# Altium schematic sheet DAC.SchDoc
size A3; SheetNumber: 2; SheetTotal: 7
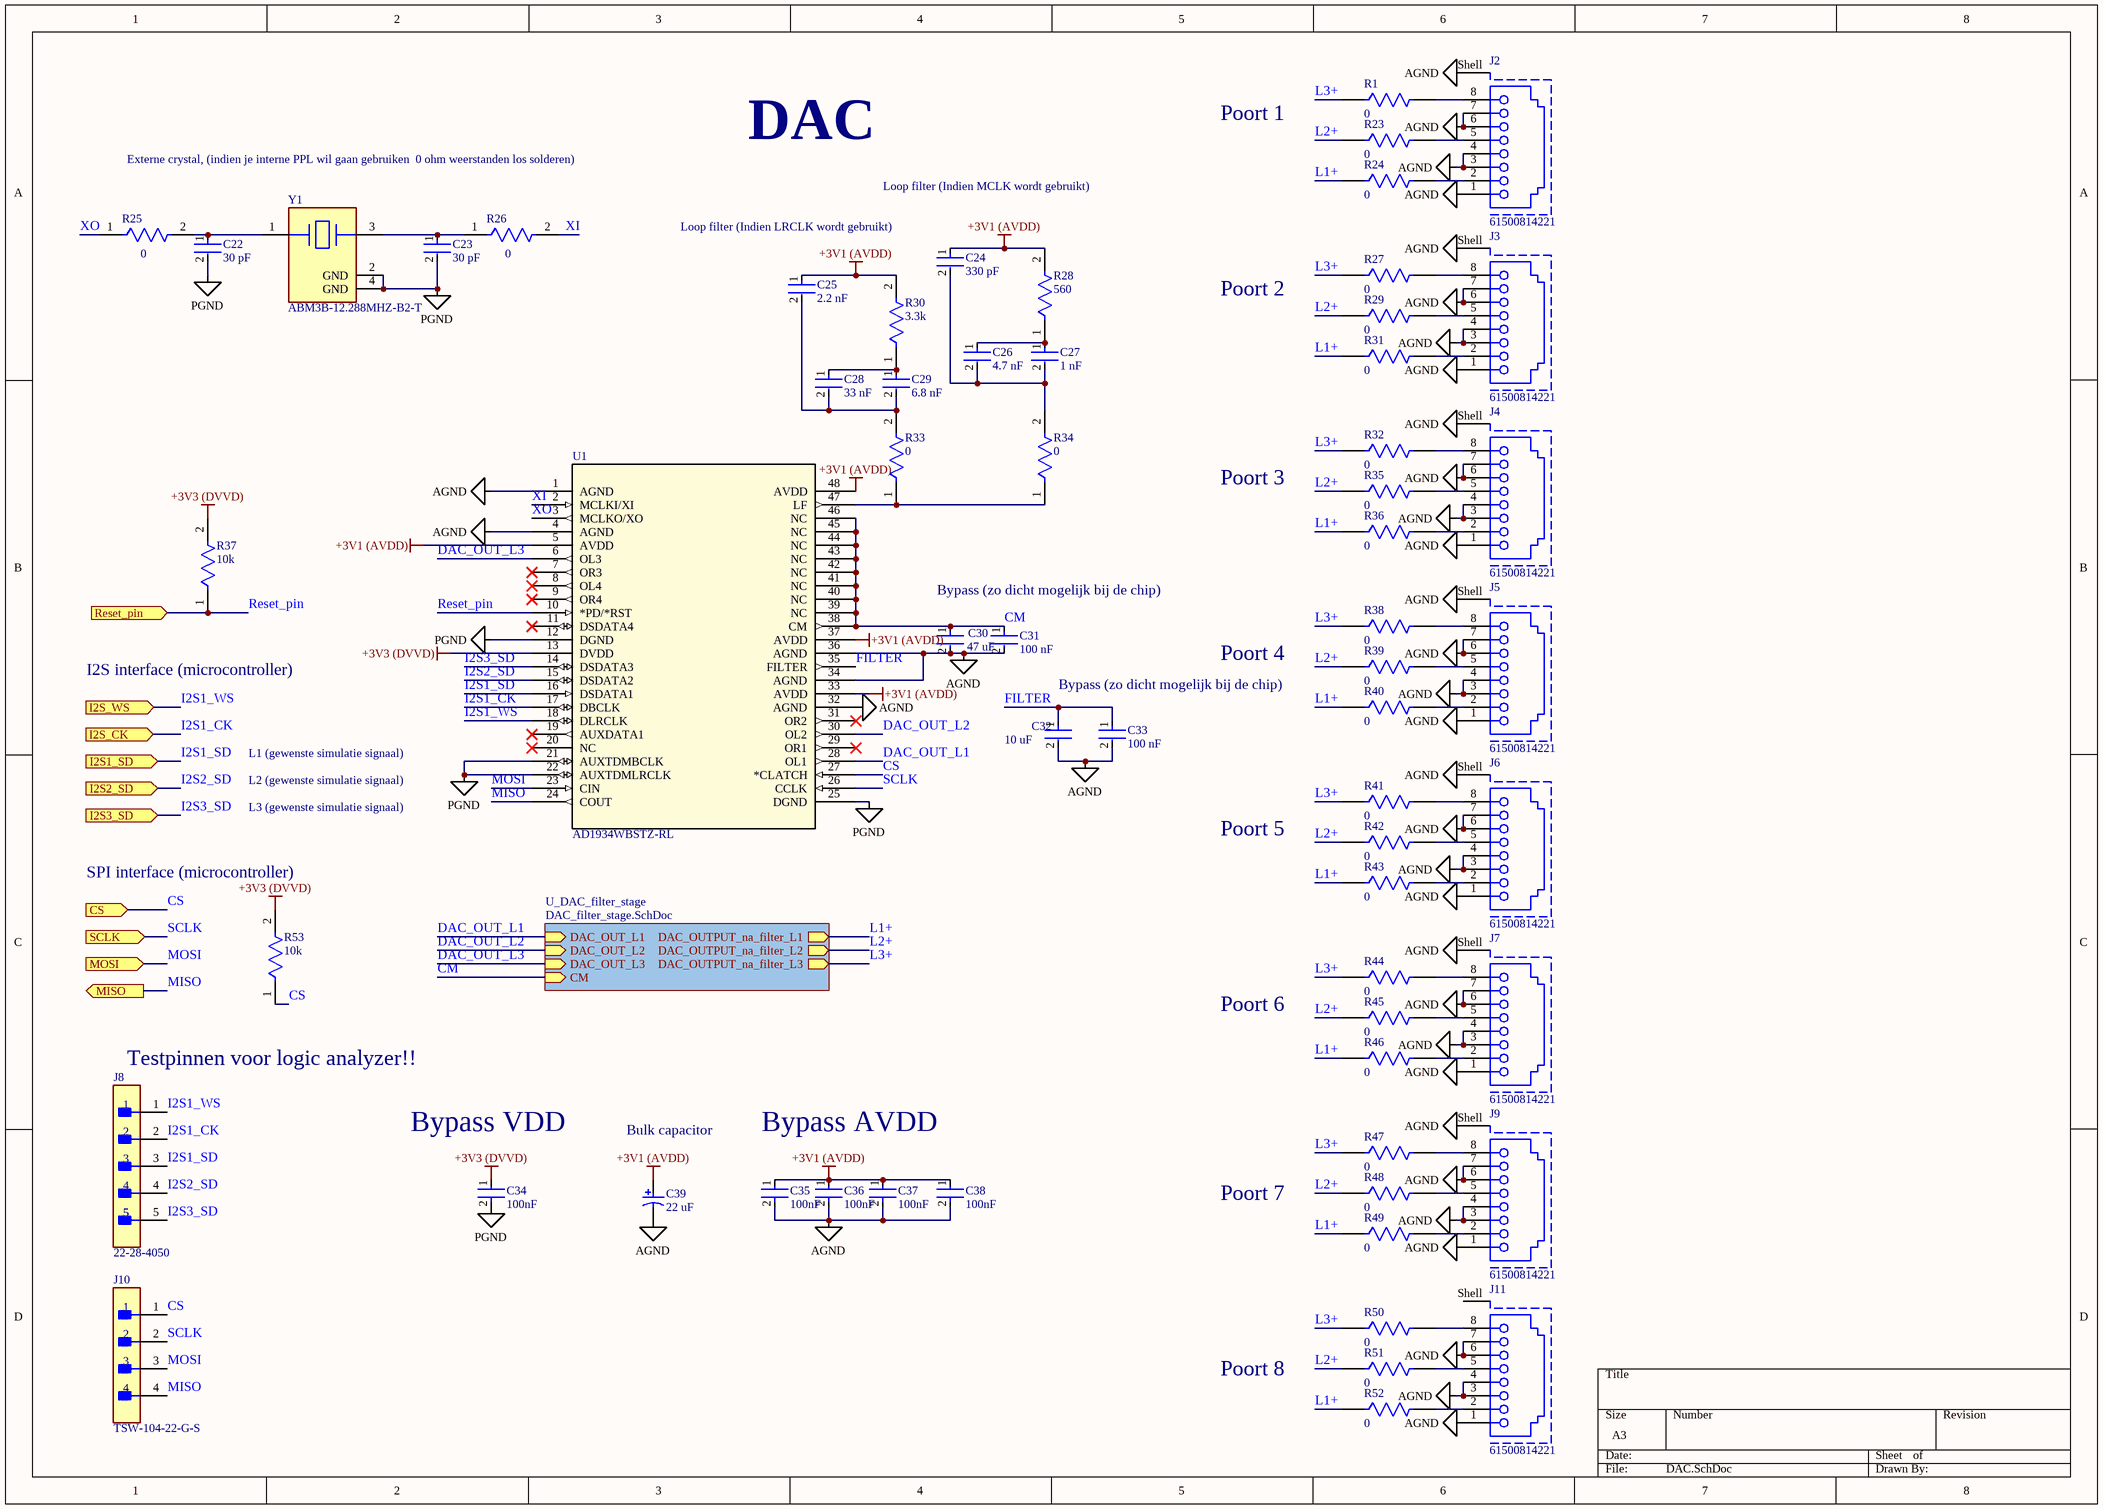
[diagram p0: DAC.SchDoc]

## Parts
C22  30 pF  [FP-AC0603-MFG]
C23  30 pF  [FP-AC0603-MFG]
C24  330 pF  [FP-C0603C-CF-MFG]
C25  2.2 nF  [FP-C0603C-CF-MFG]
C26  4.7 nF  [FP-C0603C-CF-MFG]
C27  1 nF  [FP-C0603C-CF-MFG]
C28  33 nF  [FP-C0603C-CF-MFG]
C29  6.8 nF  [FP-C0603C-CF-MFG]
C30  47 uF  [FP-C0805C476M9PACTU-MFG]
C31  100 nF  [FP-C0603C-CF-MFG]
C32  10 uF  [FP-C0603C-CF-MFG]
C33  100 nF  [FP-C0603C-CF-MFG]
C34  100nF  [FP-GRM15-MFG]
C35  100nF  [FP-GRM15-MFG]
C36  100nF  [FP-GRM15-MFG]
C37  100nF  [FP-GRM15-MFG]
C38  100nF  [FP-GRM15-MFG]
C39  22 uF  [CAPPR55-200-1100X500X1200]
J2  61500814221  [61500814221]
J3  61500814221  [61500814221]
J4  61500814221  [61500814221]
J5  61500814221  [61500814221]
J6  61500814221  [61500814221]
J7  61500814221  [61500814221]
J8  22-28-4050  [FP-22-28-4050-MFG]
J9  61500814221  [61500814221]
J10  TSW-104-22-G-S  [FP-TSW-104-22-G-S-MFG]
J11  61500814221  [61500814221]
R1  0  [FP-CRCW1206-MFG]
R23  0  [FP-CRCW1206-MFG]
R24  0  [FP-CRCW1206-MFG]
R25  0  [FP-CRCW1206-MFG]
R26  0  [FP-CRCW1206-MFG]
R27  0  [FP-CRCW1206-MFG]
R28  560  [FP-RC1608-IPC_B]
R29  0  [FP-CRCW1206-MFG]
R30  3.3k  [FP-RC1608-IPC_B]
R31  0  [FP-CRCW1206-MFG]
R32  0  [FP-CRCW1206-MFG]
R33  0  [FP-CRCW1206-MFG]
R34  0  [FP-CRCW1206-MFG]
R35  0  [FP-CRCW1206-MFG]
R36  0  [FP-CRCW1206-MFG]
R37  10k  [FP-RC1608-IPC_B]
R38  0  [FP-CRCW1206-MFG]
R39  0  [FP-CRCW1206-MFG]
R40  0  [FP-CRCW1206-MFG]
R41  0  [FP-CRCW1206-MFG]
R42  0  [FP-CRCW1206-MFG]
R43  0  [FP-CRCW1206-MFG]
R44  0  [FP-CRCW1206-MFG]
R45  0  [FP-CRCW1206-MFG]
R46  0  [FP-CRCW1206-MFG]
R47  0  [FP-CRCW1206-MFG]
R48  0  [FP-CRCW1206-MFG]
R49  0  [FP-CRCW1206-MFG]
R50  0  [FP-CRCW1206-MFG]
R51  0  [FP-CRCW1206-MFG]
R52  0  [FP-CRCW1206-MFG]
R53  10k  [FP-RC1608-IPC_B]
U1  AD1934WBSTZ-RL  [ST_48_ADI]
Y1  ABM3B-12.288MHZ-B2-T  [FP-ABM3B-MFG]

## Sub-sheets
U_DAC_filter_stage = DAC_filter_stage.SchDoc: DAC_OUT_L1 (in), DAC_OUT_L2 (in), DAC_OUT_L3 (in), CM (in), DAC_OUTPUT_na_filter_L2 (out), DAC_OUTPUT_na_filter_L1 (out), DAC_OUTPUT_na_filter_L3 (out)

## Ports
CS (in, see TOP_scheet[3C]), I2S1_SD (in, see TOP_scheet[3B], MCU[4B]), I2S2_SD (in, see TOP_scheet[3B], MCU[5B]), I2S3_SD (in, see TOP_scheet[3B], MCU[4B]), I2S_CK (in, see TOP_scheet[3B]), I2S_WS (in, see TOP_scheet[3B]), MISO (out, see TOP_scheet[3B]), MOSI (in, see TOP_scheet[3C]), Reset_pin (in, see TOP_scheet[3B]), SCLK (in, see TOP_scheet[3B])

## Nets
+3V1 (AVDD): C24.1 C25.1 C35.1 C36.1 C37.1 C38.1 C39.1 R28.2 R30.2 U1.5(AVDD) U1.33(AVDD) U1.37(AVDD) U1.48(AVDD)
+3V3 (DVVD): C34.1 R37.2 R53.2 U1.13(DVDD)
AGND: C30.2 C31.2 C32.2 C33.2 C35.2 C36.2 C37.2 C38.2 C39.2 J2.1 J2.3 J2.4 J2.6 J2.7 J2.Shell J3.1 J3.3 J3.4 J3.6 J3.7 J3.Shell J4.1 J4.3 J4.4 J4.6 J4.7 J4.Shell J5.1 J5.3 J5.4 J5.6 J5.7 J5.Shell J6.1 J6.3 J6.4 J6.6 J6.7 J6.Shell J7.1 J7.3 J7.4 J7.6 J7.7 J7.Shell J9.1 J9.3 J9.4 J9.6 J9.7 J9.Shell J11.1 J11.3 J11.4 J11.6 J11.7 U1.1(AGND) U1.4(AGND) U1.32(AGND) U1.34(AGND) U1.36(AGND)
PGND: C22.2 C23.2 C34.2 U1.12(DGND) U1.21(AUXTDMBCLK) U1.22(AUXTDMLRCLK) U1.25(DGND) Y1.2(GND) Y1.4(GND)
CM: C30.1 C31.1 U1.38(CM) U1.39(NC) U1.40(NC) U1.41(NC) U1.42(NC) U1.43(NC) U1.44(NC) U1.45(NC) U1.46(NC) ; sheet U_DAC_filter_stage/CM
CS: J10.1 R53.1 U1.27(*CLATCH) ; port CS
DAC_OUT_L1: U1.28(OL1) ; sheet U_DAC_filter_stage/DAC_OUT_L1
DAC_OUT_L2: U1.30(OL2) ; sheet U_DAC_filter_stage/DAC_OUT_L2
DAC_OUT_L3: U1.6(OL3) ; sheet U_DAC_filter_stage/DAC_OUT_L3
FILTER: C32.1 C33.1 U1.35(FILTER)
I2S1_CK: J8.2 U1.17(DBCLK) ; port I2S_CK
I2S1_SD: J8.3 U1.16(DSDATA1) ; port I2S1_SD
I2S1_WS: J8.1 U1.18(DLRCLK) ; port I2S_WS
I2S2_SD: J8.4 U1.15(DSDATA2) ; port I2S2_SD
I2S3_SD: J8.5 U1.14(DSDATA3) ; port I2S3_SD
L1+: R24.1 R31.1 R36.1 R40.1 R43.1 R46.1 R49.1 R52.1 ; sheet U_DAC_filter_stage/DAC_OUTPUT_na_filter_L1
L2+: R23.1 R29.1 R35.1 R39.1 R42.1 R45.1 R48.1 R51.1 ; sheet U_DAC_filter_stage/DAC_OUTPUT_na_filter_L2
L3+: R1.1 R27.1 R32.1 R38.1 R41.1 R44.1 R47.1 R50.1 ; sheet U_DAC_filter_stage/DAC_OUTPUT_na_filter_L3
MISO: J10.4 U1.24(COUT) ; port MISO
MOSI: J10.3 U1.23(CIN) ; port MOSI
Reset_pin: R37.1 U1.10(*PD/*RST) ; port Reset_pin
SCLK: J10.2 U1.26(CCLK) ; port SCLK
XI: R26.2 U1.2(MCLKI/XI)
XO: R25.1 U1.3(MCLKO/XO)
NetC22_1: C22.1 R25.2 Y1.1
NetC23_1: C23.1 R26.1 Y1.3
NetC24_2: C24.2 C26.2 C27.2 R34.2
NetC25_2: C25.2 C28.2 C29.2 R33.2
NetC26_1: C26.1 C27.1 R28.1
NetC28_1: C28.1 C29.1 R30.1
NetJ2_2: J2.2 R24.2
NetJ2_5: J2.5 R23.2
NetJ2_8: J2.8 R1.2
NetJ3_2: J3.2 R31.2
NetJ3_5: J3.5 R29.2
NetJ3_8: J3.8 R27.2
NetJ4_2: J4.2 R36.2
NetJ4_5: J4.5 R35.2
NetJ4_8: J4.8 R32.2
NetJ5_2: J5.2 R40.2
NetJ5_5: J5.5 R39.2
NetJ5_8: J5.8 R38.2
NetJ6_2: J6.2 R43.2
NetJ6_5: J6.5 R42.2
NetJ6_8: J6.8 R41.2
NetJ7_2: J7.2 R46.2
NetJ7_5: J7.5 R45.2
NetJ7_8: J7.8 R44.2
NetJ9_2: J9.2 R49.2
NetJ9_5: J9.5 R48.2
NetJ9_8: J9.8 R47.2
NetJ11_2: J11.2 R52.2
NetJ11_5: J11.5 R51.2
NetJ11_8: J11.8 R50.2
NetR33_1: R33.1 R34.1 U1.47(LF)

Not connected (* = marked no-connect by the designer): J11 Shell; U1 7(OR3)* 8(OL4)* 9(OR4)* 11(DSDATA4)* 19(AUXDATA1)* 20(NC)* 29(OR1)* 31(OR2)*

## Notes on the sheet
- Externe crystal, (indien je interne PPL wil gaan gebruiken  0 ohm weerstanden los solderen)
- DAC
- Poort 1
- Loop filter (Indien LRCLK wordt gebruikt)
- Loop filter (Indien MCLK wordt gebruikt)
- Poort 2
- Poort 3
- Bypass (zo dicht mogelijk bij de chip)
- I2S interface (microcontroller)
- Poort 4
- L1 (gewenste simulatie signaal)
- L2 (gewenste simulatie signaal)
- L3 (gewenste simulatie signaal)
- Poort 5
- SPI interface (microcontroller)
- Poort 6
- (near J8) Testpinnen voor logic analyzer!!
- (near C34) Bypass VDD
- Bulk capacitor
- Bypass AVDD
- Poort 7
- Poort 8

## Library data of the parts
C22 C23 = CMP-03422-001062-1: AC0603 30 pF NP0 5.00% 50 V; Manufacturer Part Number: AC0603JRNPO9BN271; Manufacturer: Yageo; Generic part Eurocircuits:: GPC0603300; Material: Ceramic; Tolerance: 0.05; Voltage Rating: 50 V; Temperature Coefficient: 15%; Automotive Grade: Grade 1; ComponentLink2URL: http://www.yageo.com/documents/recent/UPY-AC_NP0X7R_16V-to-630V_12.pdf; Value: 30 pF; Capacitance: 30 pF; Lead Free: Yes; Automotive: Yes; Package: AC0603; RoHS: TRUE; Device Class L2: Capacitors; Footprint Url: http://www.yageo.com/exep/pages/download/literatures/UPY-C_GEN_24.pdf; Height: 0.9mm; Category: Cap; Device Class L1: Passive Components; Temperature: -55°C to +125°C; Ipc Land Pattern Name: CAPC16080X80; Octopart: https://octopart.com/ac0603jrnpo9bn271-yageo-87214073; ComponentLink2Description: Datasheet; Device Class L3: Ceramic Capacitors; Temperature Characteristic: NP0; Temperature Range High: +125°C; Temperature Range Low: -55°C
C24 = CMP-2006-03056-2: CAP CER 330 pF 50V 5% X7R 0603; Manufacturer Part Number: C0603C104J5RACTU; Manufacturer: KEMET; Generic part Eurocircuits:: GPC0603331; Automotive Grade: Grade 1; Tolerance: 0.05; Material: Ceramic; Temperature Coefficient: 30ppm/°C; ComponentLink2Description: Datasheet; Voltage Rating: 50 V; Digikey Description: CAP CER 0.1UF 50V 5% X7R 0603; Temperature Range High: +125°C; Device Class L2: Capacitors; Capacitance: 330 pF; Value: 330 pF; Octopart: https://octopart.com/c0603c104j5ractu-kemet-10440638; RoHS: TRUE; Mouser Description: Multilayer Ceramic Capacitors MLCC - SMD/SMT 50volts 0.1uF X7R 5%; Temperature Range Low: -55°C; Automotive: Yes; Lead Free: Yes; ComponentLink2URL: https://api.kemet.com/component-edge/download/datasheet/C0603C100J5GACAUTO.pdf; Device Class L3: Ceramic Capacitors; Package: C0603C-CF; Category: Cap; Temperature: -55°C to +125°C; Height: 0.87mm; Temperature Characteristic: X7R; Device Class L1: Passive Components
C25 = CMP-2006-03056-2: CAP CER 2.2 nF 50V 5% X7R 0603; Manufacturer Part Number: C0603C104J5RACTU; Manufacturer: KEMET; Generic part Eurocircuits:: GPC0603222; Automotive Grade: Grade 1; Tolerance: 0.05; Material: Ceramic; Temperature Coefficient: 30ppm/°C; ComponentLink2Description: Datasheet; Voltage Rating: 50 V; Digikey Description: CAP CER 0.1UF 50V 5% X7R 0603; Temperature Range High: +125°C; Device Class L2: Capacitors; Capacitance: 2.2 nF; Value: 2.2 nF; Octopart: https://octopart.com/c0603c104j5ractu-kemet-10440638; RoHS: TRUE; Mouser Description: Multilayer Ceramic Capacitors MLCC - SMD/SMT 50volts 0.1uF X7R 5%; Temperature Range Low: -55°C; Automotive: Yes; Lead Free: Yes; ComponentLink2URL: https://api.kemet.com/component-edge/download/datasheet/C0603C100J5GACAUTO.pdf; Device Class L3: Ceramic Capacitors; Package: C0603C-CF; Category: Cap; Temperature: -55°C to +125°C; Height: 0.87mm; Temperature Characteristic: X7R; Device Class L1: Passive Components
C26 = CMP-2006-03056-2: CAP CER 33 nF 50V 5% X7R 0603; Manufacturer Part Number: C0603C104J5RACTU; Manufacturer: KEMET; Generic part Eurocircuits:: GPC0603472; Automotive Grade: Grade 1; Tolerance: 0.05; Material: Ceramic; Temperature Coefficient: 30ppm/°C; ComponentLink2Description: Datasheet; Voltage Rating: 50 V; Digikey Description: CAP CER 0.1UF 50V 5% X7R 0603; Temperature Range High: +125°C; Device Class L2: Capacitors; Capacitance: 4.7 nF; Value: 4.7 nF; Octopart: https://octopart.com/c0603c104j5ractu-kemet-10440638; RoHS: TRUE; Mouser Description: Multilayer Ceramic Capacitors MLCC - SMD/SMT 50volts 0.1uF X7R 5%; Temperature Range Low: -55°C; Automotive: Yes; Lead Free: Yes; ComponentLink2URL: https://api.kemet.com/component-edge/download/datasheet/C0603C100J5GACAUTO.pdf; Device Class L3: Ceramic Capacitors; Package: C0603C-CF; Category: Cap; Temperature: -55°C to +125°C; Height: 0.87mm; Temperature Characteristic: X7R; Device Class L1: Passive Components
C27 = CMP-2006-03056-2: CAP CER 1 nF 50V 5% X7R 0603; Manufacturer Part Number: C0603C104J5RACTU; Manufacturer: KEMET; Generic part Eurocircuits:: GPC0603102; Automotive Grade: Grade 1; Tolerance: 0.05; Material: Ceramic; Temperature Coefficient: 30ppm/°C; ComponentLink2Description: Datasheet; Voltage Rating: 50 V; Digikey Description: CAP CER 0.1UF 50V 5% X7R 0603; Temperature Range High: +125°C; Device Class L2: Capacitors; Capacitance: 1 nF; Value: 1 nF; Octopart: https://octopart.com/c0603c104j5ractu-kemet-10440638; RoHS: TRUE; Mouser Description: Multilayer Ceramic Capacitors MLCC - SMD/SMT 50volts 0.1uF X7R 5%; Temperature Range Low: -55°C; Automotive: Yes; Lead Free: Yes; ComponentLink2URL: https://api.kemet.com/component-edge/download/datasheet/C0603C100J5GACAUTO.pdf; Device Class L3: Ceramic Capacitors; Package: C0603C-CF; Category: Cap; Temperature: -55°C to +125°C; Height: 0.87mm; Temperature Characteristic: X7R; Device Class L1: Passive Components
C28 = CMP-2006-03056-2: CAP CER 33 nF 50V 5% X7R 0603; Manufacturer Part Number: C0603C104J5RACTU; Manufacturer: KEMET; Generic part Eurocircuits:: GPC0603333; Automotive Grade: Grade 1; Tolerance: 0.05; Material: Ceramic; Temperature Coefficient: 30ppm/°C; ComponentLink2Description: Datasheet; Voltage Rating: 50 V; Digikey Description: CAP CER 0.1UF 50V 5% X7R 0603; Temperature Range High: +125°C; Device Class L2: Capacitors; Capacitance: 33 nF; Value: 33 nF; Octopart: https://octopart.com/c0603c104j5ractu-kemet-10440638; RoHS: TRUE; Mouser Description: Multilayer Ceramic Capacitors MLCC - SMD/SMT 50volts 0.1uF X7R 5%; Temperature Range Low: -55°C; Automotive: Yes; Lead Free: Yes; ComponentLink2URL: https://api.kemet.com/component-edge/download/datasheet/C0603C100J5GACAUTO.pdf; Device Class L3: Ceramic Capacitors; Package: C0603C-CF; Category: Cap; Temperature: -55°C to +125°C; Height: 0.87mm; Temperature Characteristic: X7R; Device Class L1: Passive Components
C29 = CMP-2006-03056-2: CAP CER 6.8 nF 50V 5% X7R 0603; Manufacturer Part Number: C0603C104J5RACTU; Manufacturer: KEMET; Generic part Eurocircuits:: GPC0603682; Automotive Grade: Grade 1; Tolerance: 0.05; Material: Ceramic; Temperature Coefficient: 30ppm/°C; ComponentLink2Description: Datasheet; Voltage Rating: 50 V; Digikey Description: CAP CER 0.1UF 50V 5% X7R 0603; Temperature Range High: +125°C; Device Class L2: Capacitors; Capacitance: 6.8 nF; Value: 6.8 nF; Octopart: https://octopart.com/c0603c104j5ractu-kemet-10440638; RoHS: TRUE; Mouser Description: Multilayer Ceramic Capacitors MLCC - SMD/SMT 50volts 0.1uF X7R 5%; Temperature Range Low: -55°C; Automotive: Yes; Lead Free: Yes; ComponentLink2URL: https://api.kemet.com/component-edge/download/datasheet/C0603C100J5GACAUTO.pdf; Device Class L3: Ceramic Capacitors; Package: C0603C-CF; Category: Cap; Temperature: -55°C to +125°C; Height: 0.87mm; Temperature Characteristic: X7R; Device Class L1: Passive Components
C30 = CMP-2007-01008-2: CAP CER 47UF 6.3V X5R 0805; Generic part Eurocircuits:: GPC0805476-6.3; Dielectric Material: Ceramic; Dissipation Factor: 5%; Tolerance: 20%; Case Code (Imperial): 0805; Mount: PCB; Width: 1.2mm; Package Quantity: 3000; Radiation Hardening: No; Packaging: Tape and Reel; Termination: SMD/SMT; Series: C0805C; Voltage: 6.3V; Depth: 1.25mm; Dielectric: X5R; Case Code (Metric): 2012; Length: 2mm; Case/Package: 0805; REACH SVHC: No SVHC; Voltage Rating (DC): 6.3V; Capacitance: 47uF; RoHS Compliant: Yes; Height: 1.25mm; Construction: Flat; Number of Pins: 2; Voltage Rating: 6.3V; Max Operating Temperature: 85°C; Min Operating Temperature: -55°C; Parameter 1: *
C31 C33 = CMP-2006-03056-2: CAP CER 100 nF 50V 5% X7R 0603; Manufacturer Part Number: C0603C104J5RACTU; Manufacturer: KEMET; Generic part Eurocircuits:: GPC0603104; Automotive Grade: Grade 1; Tolerance: 0.05; Material: Ceramic; Temperature Coefficient: 30ppm/°C; ComponentLink2Description: Datasheet; Voltage Rating: 50 V; Digikey Description: CAP CER 0.1UF 50V 5% X7R 0603; Temperature Range High: +125°C; Device Class L2: Capacitors; Capacitance: 100 nF; Value: 100 nF; Octopart: https://octopart.com/c0603c104j5ractu-kemet-10440638; RoHS: TRUE; Mouser Description: Multilayer Ceramic Capacitors MLCC - SMD/SMT 50volts 0.1uF X7R 5%; Temperature Range Low: -55°C; Automotive: Yes; Lead Free: Yes; ComponentLink2URL: https://api.kemet.com/component-edge/download/datasheet/C0603C100J5GACAUTO.pdf; Device Class L3: Ceramic Capacitors; Package: C0603C-CF; Category: Cap; Temperature: -55°C to +125°C; Height: 0.87mm; Temperature Characteristic: X7R; Device Class L1: Passive Components
C32 = CMP-2006-03056-2: CAP CER 10 uF 50V 5% X7R 0603; Manufacturer Part Number: C0603C104J5RACTU; Manufacturer: KEMET; Generic part Eurocircuits:: GPC0603106-10; Automotive Grade: Grade 1; Tolerance: 0.05; Material: Ceramic; Temperature Coefficient: 30ppm/°C; ComponentLink2Description: Datasheet; Voltage Rating: 50 V; Digikey Description: CAP CER 0.1UF 50V 5% X7R 0603; Temperature Range High: +125°C; Device Class L2: Capacitors; Capacitance: 10 uF; Value: 10 uF; Octopart: https://octopart.com/c0603c104j5ractu-kemet-10440638; RoHS: TRUE; Mouser Description: Multilayer Ceramic Capacitors MLCC - SMD/SMT 50volts 0.1uF X7R 5%; Temperature Range Low: -55°C; Automotive: Yes; Lead Free: Yes; ComponentLink2URL: https://api.kemet.com/component-edge/download/datasheet/C0603C100J5GACAUTO.pdf; Device Class L3: Ceramic Capacitors; Package: C0603C-CF; Category: Cap; Temperature: -55°C to +125°C; Height: 0.87mm; Temperature Characteristic: X7R; Device Class L1: Passive Components
C34-C38 = CMP-2100-03641-2: CAP CER 0.1UF 16V X7R 0402; Manufacturer Part Number: GRM155R71C104KA88D; Manufacturer: Murata; Eurocircuits generic parts: GPC0402104; Standoff Height: 0mm; Tolerance: 10%; Voltage Rating: 16Vdc; Material: Ceramic; Capacitance: 0.10μF; Value: 0.10μF; RoHS: TRUE; Temperature Characteristic: X7R; Octopart: https://octopart.com/grm155r71c104ka88d-murata-196880; Digikey Description: CAP CER 0.1UF 16V X7R 0402; Device Class L3: Ceramic Capacitors; Height: 0.55mm; ComponentLink2Description: Datasheet; Temperature Range Low: -55°C; Ipc Land Pattern Name: CAPC10050X219; ComponentLink2URL: https://search.murata.co.jp/Ceramy/image/img/A01X/G101/ENG/GRM155R71H471KA01-01A.pdf; Device Class L1: Passive Components; Lead Free: yes; Category: Cap; Package: GRM15; Temperature: -55°C to +125°C; Device Class L2: Capacitors; Temperature Range High: +125°C; Mouser Description: 0402 0.1 uF 16V ±10 % Tolerance X7R SMT Multilayer Ceramic Capacitor
C39 = CMP-1665-00036-2: Aluminum Electrolytic Capacitor, 22 uF, +/- 20%, 50 V, -40 to 85 degC, 2-Pin THD, RoHS, Bulk; Manufacturer: Panasonic; Ripple Current: 100mA; Life (Hours): 2000Hour; Voltage: 50V; Dissipation Factor: 0.12%; Leakage Current: 3uA; Lead/Base Style: Straight; Capacitance: 22uF; Lead Diameter: 0.5mm; Max Operating Temperature: 85degC; Height: 11mm; Package Reference: CAPPR55-200-1100X500X1200; Radiation Hardening: No; RoHSCompliant: true; Termination: Radial; Case/Package: Radial; REACH SVHC: NoSVHC; Height - Seated (Max): 0.472inch; Min Operating Temperature: -40degC; Packaging: Bulk; Manufacturer URL: http://www.panasonic.com/; Length: 11mm; Tolerance: 20%; Voltage Rating: 50V; Voltage Rating (DC): 50V; Datasheet URL: https://industrial.panasonic.com/cdbs/www-data/pdf/RDF0000/ABA0000C1218.pdf; Lead Pitch: 2mm; Ripple Current (AC): 100mA; Package Description: 2-Pin Radial Lead, Dia 5 mm, Height 12 mm; Diameter: 5mm; Datasheet Version: Rev. 05, 10/2016; Package Quantity: 200; Mount: ThroughHole
J2-J7 J9 J11 = CMP-1502-01695-2: NexarPartId: 8917800; Number of Contacts: 8; Operating Supply Voltage: 120V; Gender: Female; Contact Resistance: 20mΩ; Number of Ports: 1; Direction: Down; Shielding: Shielded; Insulation Resistance: 500MΩ; Current Rating: 1.5A; Connector Type: RJ45, Socket; Mount: PCB, Through Hole; Housing Material: PBT; RoHS: Compliant; Depth: 21.2mm; Max Operating Temperature: 85°C; Contact Material: Copper; REACH SVHC: Unknown; Voltage Rating (DC): 120V; Orientation: Right Angle; Number of Positions: 8; Number of Rows: 1; Insulation Material: PBT; Width: 15.88mm; Flammability Rating: UL94 V-0; Termination: Through Hole; Min Operating Temperature: -40°C; Voltage Rating (AC): 120V; Length: 13.65mm; Height: 19.95mm; Contact Plating: Gold; Color: Black
J8 = CMP-00257-00278173-1: GENERIC PART NUMBER: GPHA-1X05 / 22-28-4050 KK® 254 Breakaway Header, Vertical, 5 Circuits, Tin (Sn) Plating, Mating Pin Length 6.09mm; NexarPartId: 278173; Voltage Rating: 250V; Number of Contacts: 5; Contact Resistance: 20mΩ; Gender: Male; Pitch: 2.54mm; Connector Type: Male Pin; Current Rating: 4A; Glow Wire Compliant: Non-compliant; Max Voltage Rating (DC): 250.25kV; Flammability Rating: UL94 V-0; Min Operating Temperature: 0°C; REACH SVHC: Unknown; Lead Free: Lead Free; Termination: Solder; RoHS: Compliant; Schedule B: 8536694040; Number of Circuits: 5; Mount: Through Hole; Lead Pitch: 2.54mm; Height: 2.29mm; Voltage Rating (DC): 250V; Max Operating Temperature: 75°C; Width: 2.49mm; Radiation Hardening: No; Contact Plating: Tin; Orientation: Vertical; Length: 12.7mm; Number of Rows: 1; Housing Material: Thermoplastic; Contact Material: Brass; Packaging: Bulk; Contact Mating Length: 6.096mm; Housing Color: Black; Color: Black; Number of Positions: 5; GENERIC PART NUMBER: GPHA-1X05
J10 = CMP-02766-001236-1: GENERIC PART NUMBER: GPHA-1X04 / CONN HEADER VERT 4POS 2.54MM; Number of Contacts: 4; Gender: Male; Termination: Solder; Pitch: 2.54mm; Mount: Through Hole; Number of Rows: 1; Packaging: Bulk; Contact Material: Bronze; Contact Plating: Gold; REACH SVHC: No SVHC; Radiation Hardening: No; GENERIC PART NUMBER: GPHA-1X04
R1 R23-R27 R29 R31-R36 R38-R52 = CMP-00030-39388935-1: CRCW12060000ZSTA Zero Ohm Resistor, Jumper, 1206 [3216 Metric], Thick Film, 250 mW, Surface Mount; Voltage Rating (DC): 200V; Max Power Dissipation: 250mW; Temperature Coefficient: 100ppm/°C; Resistance: 0Ω; Packaging: Cut Tape; Lead Free: Contains Lead; Height: 609.6µm; Military Standard: Not; Min Operating Temperature: -55°C; Weight: 10.007382mg; Depth: 1.6mm; Termination: SMD/SMT; Mount: Surface Mount; RoHS: Compliant; Case Code (Metric): 3216; Max Operating Temperature: 155°C; NexarPartId: 39388935; Length: 3.2mm; Features: Automotive AEC-Q200; Case Code (Imperial): 1206; Composition: Thick Film; Case/Package: 1206; Voltage Rating: 200V; Width: 1.6mm; Contact Plating: Lead, Tin; Number of Terminations: 2; REACH SVHC: Unknown; Power Rating: 250mW; Radiation Hardening: No
R28 = CMP-13261-004935-1: Res Thick Film 0603 560Ω 1% 0.1W ±100ppm/°C Molded SMD T/R / Generic part Eurocircuits: / GPR060310K; Generic part Eurocircuits:: GPR1206560R; Voltage Rating (DC): 50V; Power Rating: 100mW; Resistance: 560; Contact Plating: Tin; Depth: 0.8mm; Width: 800um; Tolerance: 1%; Lead Free: Lead Free; Composition: Thick Film; Military Standard: Not; Temperature Coefficient: 100ppm/°C; Radiation Hardening: No; Length: 1.6mm; Case/Package: 0603; Max Operating Temperature: 155°C; Packaging: Tape and Reel; Min Operating Temperature: -55°C
R30 = CMP-13261-004935-1: Res Thick Film 0603 3.3kΩ 1% 0.1W ±100ppm/°C Molded SMD T/R / Generic part Eurocircuits: / GPR060310K; Generic part Eurocircuits:: GPR12063K3; Voltage Rating (DC): 50V; Power Rating: 100mW; Resistance: 3.3k; Contact Plating: Tin; Depth: 0.8mm; Width: 800um; Tolerance: 1%; Lead Free: Lead Free; Composition: Thick Film; Military Standard: Not; Temperature Coefficient: 100ppm/°C; Radiation Hardening: No; Length: 1.6mm; Case/Package: 0603; Max Operating Temperature: 155°C; Packaging: Tape and Reel; Min Operating Temperature: -55°C
R37 R53 = CMP-13261-004935-1: Res Thick Film 0603 10kΩ 1% 0.1W ±100ppm/°C Molded SMD T/R / Generic part Eurocircuits: / GPR060310K; Voltage Rating (DC): 50V; Power Rating: 100mW; Resistance: 10k; Contact Plating: Tin; Depth: 0.8mm; Width: 800um; Tolerance: 1%; Lead Free: Lead Free; Composition: Thick Film; Military Standard: Not; Temperature Coefficient: 100ppm/°C; Radiation Hardening: No; Length: 1.6mm; Case/Package: 0603; Max Operating Temperature: 155°C; Packaging: Tape and Reel; Min Operating Temperature: -55°C; Generic part Eurocircuits:: GPR060310K
U1 = AD1934WBSTZ-RL: No Description Available; Mfr_Name: Analog Devices Inc; RefDes: RefDes; Type: Type
Y1 = CMP-1688-00004-2: Crystal 12.288MHz ±20ppm 18pF SMD-4 5mm x 3.2mm; ESR (Equivalent Series Resistance): 70R; Frequency Stability: 50ppm; Termination: SMD/SMT; Radiation Hardening: No; Load Capacitance: 18pF; Number of Pins: 4; Package Quantity: 1000; Depth: 3.2mm; Resistor Type: Ceramic; Tolerance: 20ppm; Series: ABM3B; Case/Package: CSMD; Packaging: Tape and Reel; Mount: Surface Mount; Max Operating Temperature: 70°C; Frequency Tolerance: 20ppm; Width: 3.2mm; Height: 0.043inch; Operating Frequency: 12.288 MHz; Min Operating Temperature: -20°C; REACH SVHC: No SVHC; Frequency: 12.288MHz; Lead Free: Lead Free; Length: 5mm